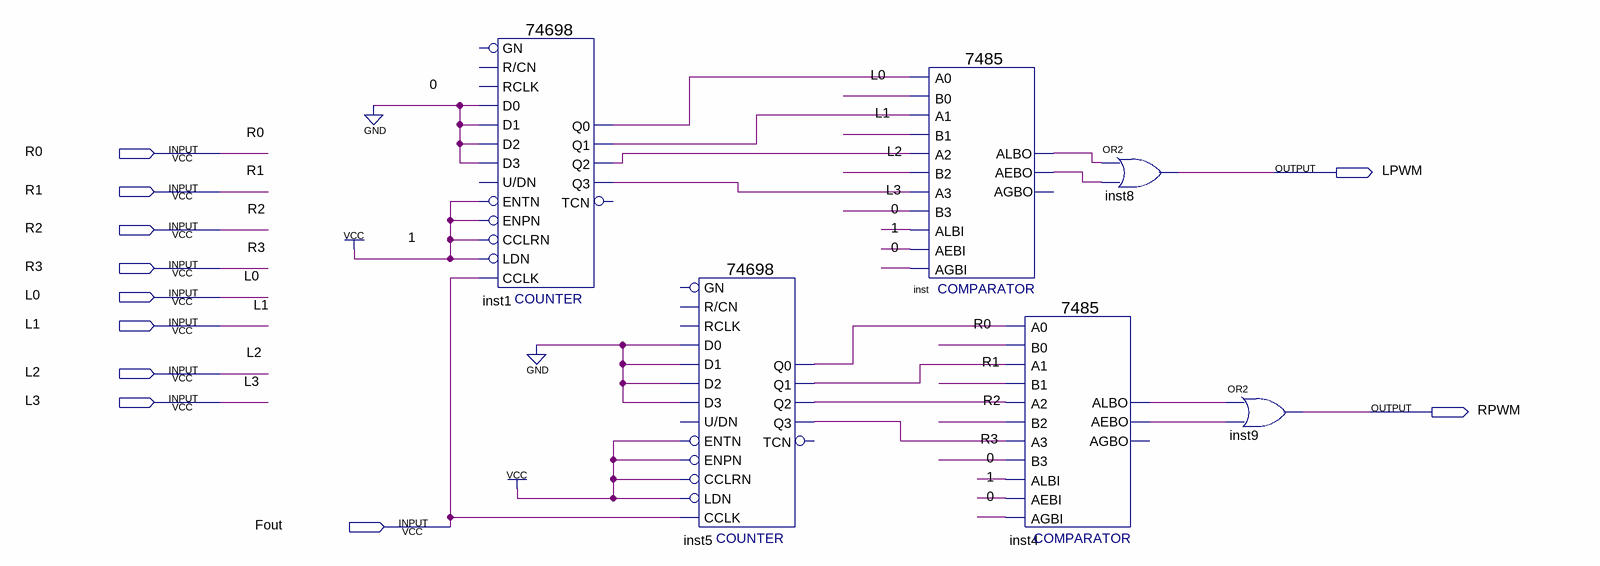
[diagram p0: schematic sheet]
// Quartus schematic 219finalproject.bdf as structural Verilog: 6 symbols, 11 pins
module \219finalproject  (
  input  R0,
  input  R1,
  input  R2,
  input  R3,
  input  L0,
  input  L1,
  input  L2,
  input  L3,
  input  Fout,
  output LPWM,
  output RPWM
);

  wire inst1_q0, inst1_q1, inst1_q2, inst1_q3, inst4_aebo, inst4_albo, inst5_q0, inst5_q1, inst5_q2,
       inst5_q3, inst_aebo, inst_albo;

  \74698  inst1 (
    .D0(1'b0), .D1(1'b0), .D2(1'b0), .D3(1'b0), .ENTN(1'b1), .CCLRN(1'b1), .ENPN(1'b1), .CCLK(Fout),
    .LDN(1'b1), .Q0(inst1_q0), .Q1(inst1_q1), .Q2(inst1_q2), .Q3(inst1_q3));  // open: R/CN, RCLK, U/DN, GN, TCN
  \74698  inst5 (
    .D0(1'b0), .D1(1'b0), .D2(1'b0), .D3(1'b0), .ENTN(1'b1), .CCLRN(1'b1), .ENPN(1'b1), .CCLK(Fout),
    .LDN(1'b1), .Q0(inst5_q0), .Q1(inst5_q1), .Q2(inst5_q2), .Q3(inst5_q3));  // open: R/CN, RCLK, U/DN, GN, TCN
  \7485  inst (
    .A3(inst1_q3), .B2(L2), .A2(inst1_q2), .AEBI(1'b1), .AGBI(1'b0), .ALBI(1'b0), .A0(inst1_q0), .B0(L0),
    .B3(L3), .A1(inst1_q1), .B1(L1), .ALBO(inst_albo), .AEBO(inst_aebo));  // open: AGBO
  \7485  inst4 (
    .A3(inst5_q3), .B2(R2), .A2(inst5_q2), .AEBI(1'b1), .AGBI(1'b0), .ALBI(1'b0), .A0(inst5_q0), .B0(R0),
    .B3(R3), .A1(inst5_q1), .B1(R1), .ALBO(inst4_albo), .AEBO(inst4_aebo));  // open: AGBO
  or inst8 (LPWM, inst_albo, inst_aebo);
  or inst9 (RPWM, inst4_albo, inst4_aebo);
endmodule
